# Altium schematic sheet DRV_BJT.SchDoc
size A3; SheetNumber: 4; SheetTotal: 9
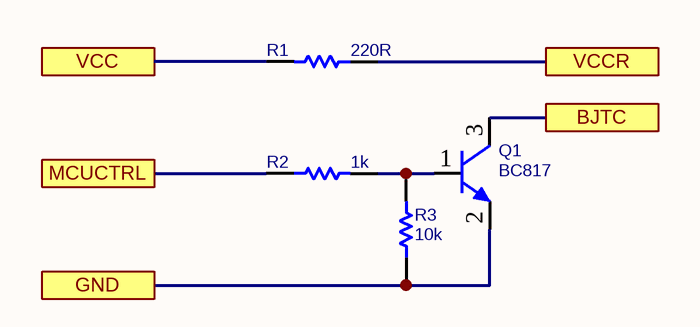
[diagram p0: DRV_BJT.SchDoc]

## Parts
Q1  BC817  [SOT23_3]
R1  220R  [R0603]
R2  1k  [R0603]
R3  10k  [R0603]

## Ports
BJTC, GND, MCUCTRL, VCC, VCCR

## Nets
BJTC: Q1.3(C) ; port BJTC
GND: Q1.2(E) R3.1 ; port GND
MCUCTRL: R2.1 ; port MCUCTRL
VCC: R1.2 ; port VCC
VCCR: R1.1 ; port VCCR
NetQ1_1: Q1.1(B) R2.2 R3.2

## Library data of the parts
Q1 = NPN_BC817_SOT23: BJT, NPN, 45v, 0.5A, SMD, SOT23; PARAM: 0.5A, Hfe100~600; PARAM2: 45v, 250mW; MANF: NXP, ON; MANF_P#: BC817; VALUE: BC817
R1 = RES_SMD_1206: RESISTOR, SMD, 1206; PARAM: -W; DESC: DESCRIPTION; DIST#: MOUSER; PARAM2: 1%; MANF_P#: -; MANF: -; ASSEMBLY: ASSEMBLY; PRICE: 100= 0.5$; VALUE: 220R
R2 R3 = RES_SMD_0603: RESISTOR, SMD; PARAM: -W; DESC: DESCRIPTION; DIST#: MOUSER; PARAM2: 1%; MANF_P#: -; MANF: -; ASSEMBLY: ASSEMBLY; PRICE: 100= 0.5$